# EAGLE design divider (EAGLE 9.6.2)
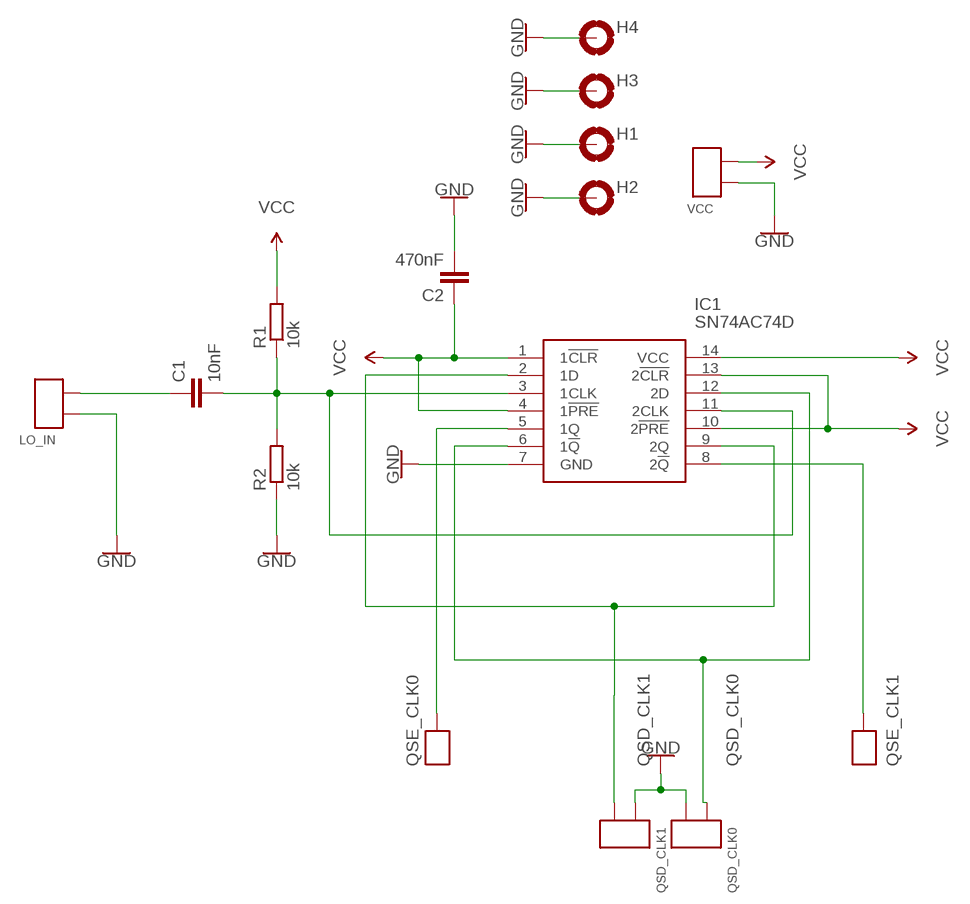
[diagram p0: schematic, sheet 1]

## Parts
C1  10nF  C_0805_SMD  [C0805]
C2  470nF  C_0805_SMD  [C0805]
H1  MOUNT-PAD-ROUND3.0  [3,0-PAD]
H2  MOUNT-PAD-ROUND3.0  [3,0-PAD]
H3  MOUNT-PAD-ROUND2.8  [2,8-PAD]
H4  MOUNT-PAD-ROUND2.8  [2,8-PAD]
IC1  SN74AC74D  [SOIC127P600X175-14N]
LO_IN  2X_SMD_PTH_PIN  [2X_SMD_PTH]
QSD_CLK0  2X_SMD_PTH_PIN  [2X_SMD_PTH]
QSD_CLK1  2X_SMD_PTH_PIN  [2X_SMD_PTH]
R1  10k  R_0805_SMD  [R0805W]
R2  10k  R_0805_SMD  [R0805W]
TX_CLK0  SMD_PTH_PIN  [SMD_PTH_PIN]
TX_CLK1  SMD_PTH_PIN  [SMD_PTH_PIN]
VCC  2X_SMD_PTH_PIN  [2X_SMD_PTH]

## Nets
GND: C2.2 H1.B3,0(MOUNT) H2.B3,0(MOUNT) H3.B2,8(MOUNT) H4.B2,8(MOUNT) IC1.7(GND) LO_IN.P$1(PIN0) LO_IN.T$1(PIN0) QSD_CLK0.P$2(PIN1) QSD_CLK0.T$2(PIN1) QSD_CLK1.P$1(PIN0) QSD_CLK1.T$1(PIN0) R2.1 VCC.P$1(PIN0) VCC.T$1(PIN0)
N$1: C1.2 IC1.3(1CLK) IC1.11(2CLK) R1.1 R2.2
N$2: C1.1 LO_IN.P$2(PIN1) LO_IN.T$2(PIN1)
QSD_CLK0: IC1.6(1!Q) IC1.12(2D) QSD_CLK0.P$1(PIN0) QSD_CLK0.T$1(PIN0)
QSD_CLK1: IC1.2(1D) IC1.9(2Q) QSD_CLK1.P$2(PIN1) QSD_CLK1.T$2(PIN1)
QSE_CLK0: IC1.5(1Q) TX_CLK0.P$1 TX_CLK0.P$2
QSE_CLK1: IC1.8(2!Q) TX_CLK1.P$1 TX_CLK1.P$2
VCC: C2.1 IC1.1(1!CLR) IC1.4(1!PRE) IC1.10(2!PRE) IC1.13(2!CLR) IC1.14(VCC) R1.2 VCC.P$2(PIN1) VCC.T$2(PIN1)

## Library data of the parts
C1 C2 = mylib:C_0805_SMD
H1-H4 = holes:MOUNT-PAD-ROUND: MOUNTING PAD, round
IC1 = SN74AC74D:SN74AC74D: Dual Positive-Edge-Triggered D-Type Flip-Flops With Clear and Preset Source: Datasheet <http://www.ti.com/lit/gpn/SN74AC74>; ARROW_PART_NUMBER: SN74AC74D; ARROW_PRICE-STOCK: https://www.arrow.com/en/products/sn74ac74d/texas-instruments?region=nac; DESCRIPTION: Dual Positive-Edge-Triggered D-Type Flip-Flops With Clear and Preset; HEIGHT: 1.75mm; MANUFACTURER_NAME: Texas Instruments; MANUFACTURER_PART_NUMBER: SN74AC74D; MOUSER_PART_NUMBER: 595-SN74AC74D; MOUSER_PRICE-STOCK: https://www.mouser.co.uk/ProductDetail/Texas-Instruments/SN74AC74D?qs=NLW4NjXEBS62VvV8UtQwag%3D%3D
LO_IN QSD_CLK0 QSD_CLK1 VCC = mylib:2X_SMD_PTH_PIN
R1 R2 = mylib:R_0805_SMD
TX_CLK0 TX_CLK1 = mylib:SMD_PTH_PIN

## Board
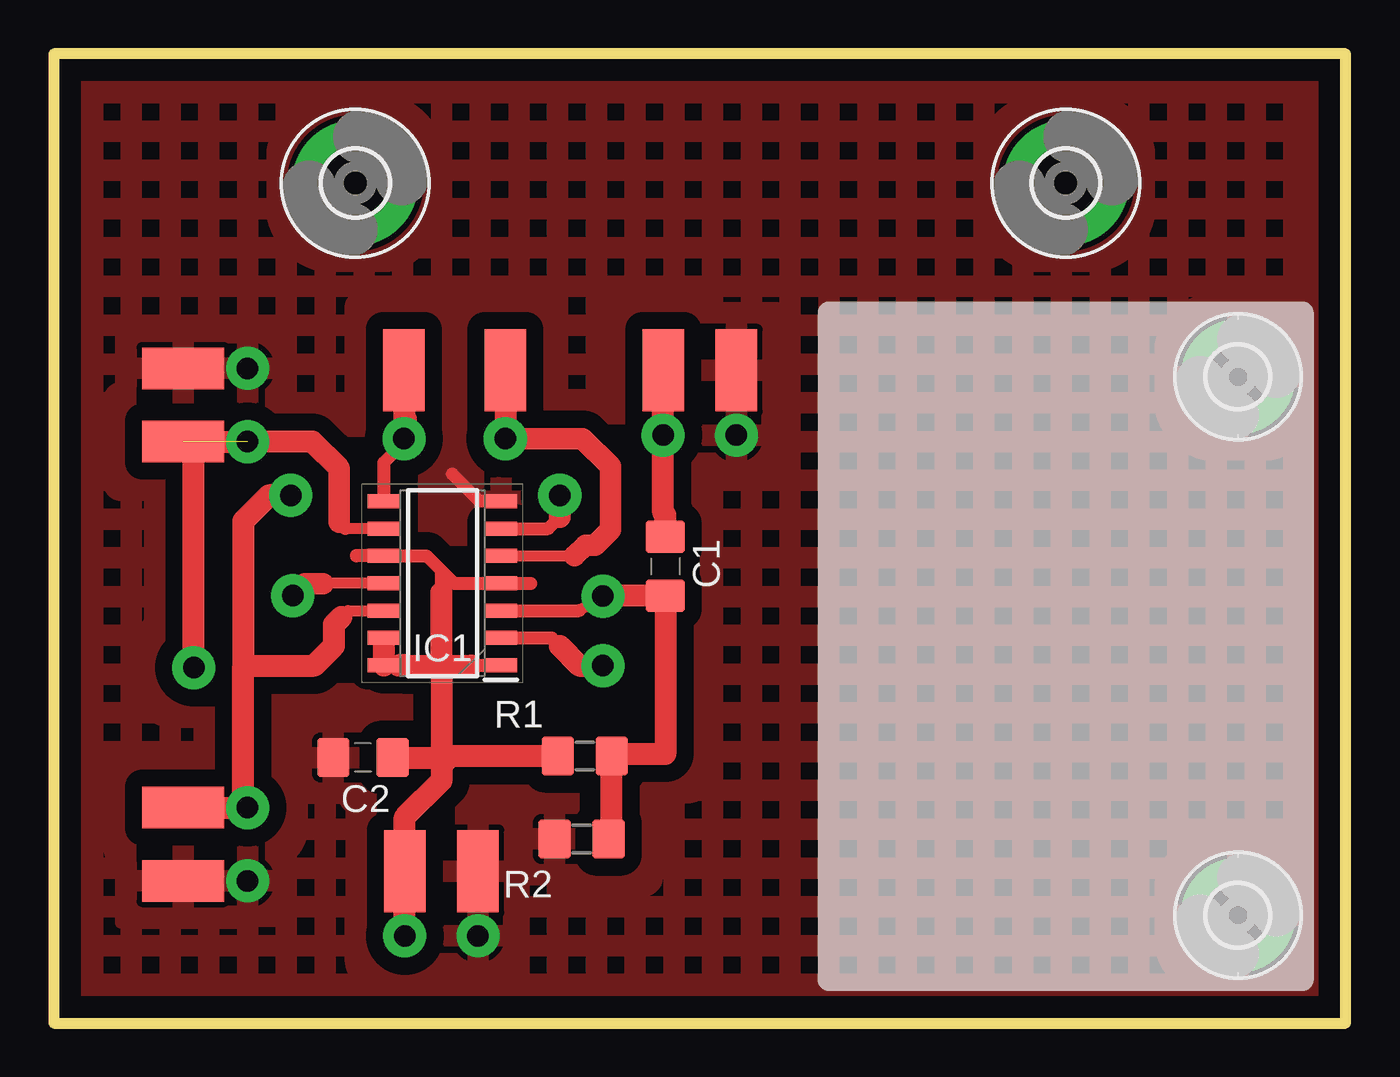
[diagram p1: board, top side]
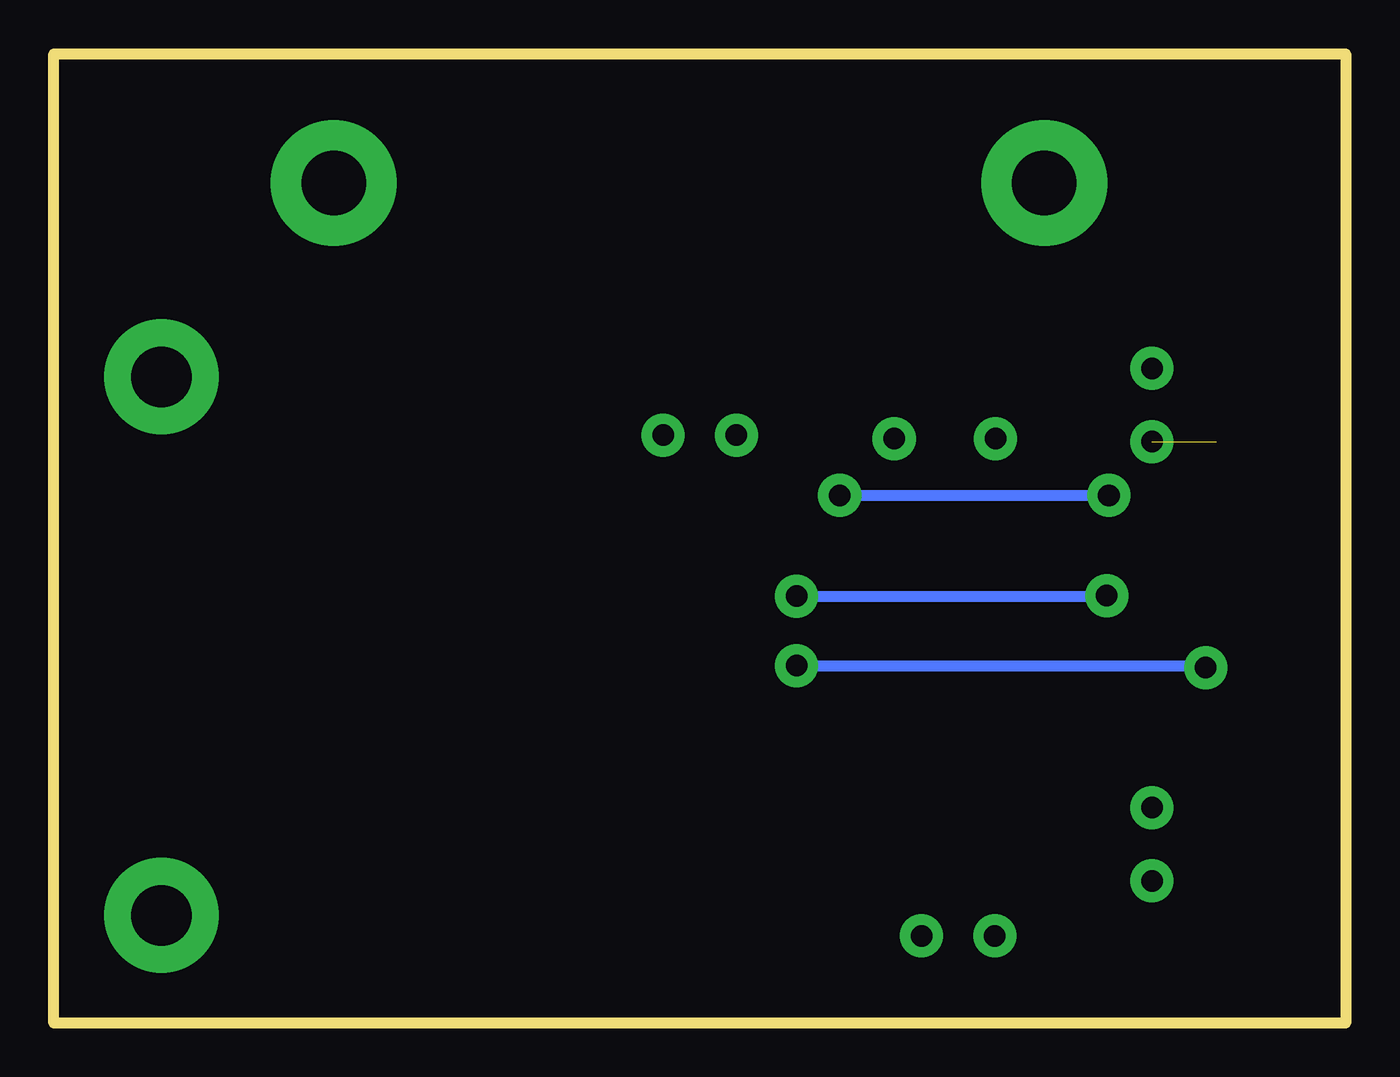
[diagram p2: board, bottom side, seen from below]

Size 60 x 45 mm. Coordinates in mm from the lower left corner, seen from the top.
Outline: 0,0 60,0 60,45 0,45 0,0
Copper layers (1*16): Top 0.035mm / dielectric 1.5mm / Bottom 0.035mm
Design rules "default": minimum track width 6mil, minimum drill 0.35mm, track to track 6mil, track to pad 6mil, pad to pad 6mil, via to via 6mil, smd to smd 6mil, copper to edge 40mil, drill to drill 6mil, minimum pad ring 10mil, minimum via ring 8mil, stop-mask expansion 4mil, vias tented up to drill 0mil, thermal gap 10mil

### Footprints (pad centres in the part's own frame; a part is rotated, then mirrored left to right if it is on the bottom)
C0805 = smd 1.5 x 1.8: 1 -1.377,0; 2 1.377,0
3,0-PAD = drill 3 pad 5.842: B3,0 0,0
2,8-PAD = drill 2.8 pad 5.334: B2,8 0,0
SOIC127P600X175-14N = smd 1.525 x 0.65: 1 -2.712,3.81; 2 -2.712,2.54; 3 -2.712,1.27; 4 -2.712,0; 5 -2.712,-1.27; 6 -2.712,-2.54; 7 -2.712,-3.81; 8 2.712,-3.81; 9 2.712,-2.54; 10 2.712,-1.27; 11 2.712,0; 12 2.712,1.27; 13 2.712,2.54; 14 2.712,3.81
2X_SMD_PTH = smd 3.81 x 1.93: P$1 0,1.7; P$2 0,-1.7 | drill 1 pad 2: T$1 3,1.7; T$2 3,-1.7
R0805W = smd 1.5 x 1.8: 1 -1.252,0; 2 1.252,0
SMD_PTH_PIN = smd 1.93 x 3.81: P$1 0,0 | drill 1 pad 2: P$2 0,3.163

### Placement (x,y rotation side)
C1  28.4,21.21 270 top
C2  14.36,12.33 180 top
H1  47,39 0 top
H2  14,39 0 top
H3  55,5 0 top
H4  55,30 0 top
IC1  18.05,20.42 180 top
LO_IN  30,30.3 270 top
QSD_CLK0  6,8.3 0 top
QSD_CLK1  6,28.7 0 top
R1  24.66,12.4 180 top
R2  24.51,8.55 0 top
TX_CLK0  20.97,30.3 180 top
TX_CLK1  16.26,30.3 180 top
VCC  18,7.05 270 top

### Tracks (layer width: path | path; a pad name or v marks a point on that pad's centre or on a via)
GND
  Top 0.61: IC1.7 19.77,24.23 18.5,25.5
  pour Top (isolate 0.8, hatched): -2.5,47.5 -2.5,-3 62,-3 62,47.5
N$1  (via drill 1 pad 2)
  Top 0.508: 24.4,19.15 v25.5,19.82 | IC1.11 12.52,20.42 12.5,20.4
  Top 0.61: IC1.3 24.4,19.15
  Top 1: 12.5,20.4 11.65,20.4 v11.1,19.85
  Top 1.016: 25.08,19.83 v25.5,19.82 25.51,19.83 C1.2 28.4,12.5 26.01,12.5 R1.1 25.91,8.7 R2.2
  Bottom 0.508: v25.5,19.82 11.12,19.82 v11.1,19.85
N$2
  Top 1.016: LO_IN.P$2 LO_IN.T$2 28.3,23.7 28.4,23.6 C1.1
QSD_CLK0  (via drill 1 pad 2)
  Top 0.508: IC1.12 13.65,19.15 13.35,18.85
  Top 0.61: IC1.6 22.96,22.96 23.5,23.5
  Top 1.016: 23.5,23.5 v23.5,24.5 | v11,24.5 10,24.5 8.8,23.3 8.8,16.6 | QSD_CLK0.P$1 QSD_CLK0.T$1 8.8,10 8.8,16.6 | 13.35,18.85 13,18.5 13,17.5 12.1,16.6 8.8,16.6
  Bottom 0.508: v23.5,24.5 v11,24.5
QSD_CLK1  (via drill 1 pad 2)  (1 unrouted)
  Top 0.508: IC1.9 13.54,22.96
  Top 0.61: 13.54,22.96 13.25,23.25 | IC1.2 22.62,17.88 23.12,17.88 23.5,17.5
  Top 1: 13.25,23.25 13.25,25.75
  Top 1.016: 23.5,17.5 24.4,16.6 v25.5,16.6 | v6.5,16.5 6.5,27 QSD_CLK1.T$2 12,27 13.25,25.75
  Bottom 0.508: v25.5,16.6 6.6,16.6
  Bottom 1.016: 6.6,16.6 v6.5,16.5
QSE_CLK0
  Top 0.508: IC1.5 24.19,21.69
  Top 1: 24.19,21.69 24.69,22.19 25.14,22.19 25.85,22.9 25.85,25.85 24.56,27.14 TX_CLK0.P$2
  Top 1.016: TX_CLK0.P$1 TX_CLK0.P$2
QSE_CLK1
  Top 0.508: 16.34,28.06 16.34,27.21 TX_CLK1.P$2
  Top 0.61: IC1.8 15.34,26.04 16.35,27.05
  Top 1.016: TX_CLK1.P$1 TX_CLK1.P$2 | 16.35,27.05 16.35,28.05 16.34,28.06
VCC
  Top 0.508: IC1.14 15.34,17 | 15.34,17.5 IC1.13 | 20.5,16.61 IC1.1
  Top 0.61: 20.5,16.61 IC1.1 | 18,21 17.31,21.69 IC1.10 14.05,21.69 14.05,21.7 | 18,21 18.58,20.42 IC1.4 22.15,20.42 22.15,20.4 | 18,17 18,16.61 | 18,20 18,21 | 16,16.61 15.5,16.61 IC1.14 | 16.35,16.6 16.34,16.61 | IC1.1 | IC1.1 19.4,16.6
  Top 1.016: 18,17 18,20 | 16.35,16.6 17.99,16.6 18,16.61 | 18,16.61 18.01,16.6 19.4,16.6 | IC1.14 15.34,17.5 | IC1.14 15.34,17.5 | IC1.14 15.34,17.5 | 16.34,16.61 16,16.61 | 23.36,12.45 R1.2 18.4,12.4 | 18,16.61 18,12 | 18,12 18,11.25 16.3,9.55 VCC.P$2 VCC.T$2 | 18.4,12.4 18,12 | C2.1 18.33,12.33 18.4,12.4